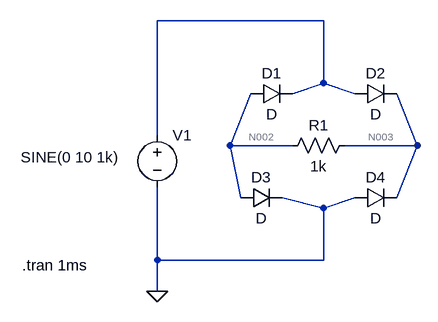
[diagram p0: schematic FULL_WAVE_GUI.asc]
FULL_WAVE_GUI.asc, the LTspice schematic file:
Version 4
SHEET 1 880 680
WIRE 256 64 0 64
WIRE 256 160 256 64
WIRE 208 176 256 160
WIRE 304 176 256 160
WIRE 0 240 0 64
WIRE 112 256 144 176
WIRE 208 256 112 256
WIRE 400 256 368 176
WIRE 400 256 288 256
WIRE 128 336 112 256
WIRE 368 336 400 256
WIRE 256 352 192 336
WIRE 256 352 304 336
WIRE 0 432 0 320
WIRE 256 432 256 352
WIRE 256 432 0 432
WIRE 0 480 0 432
FLAG 0 480 0
SYMBOL voltage 0 224 R0
WINDOW 3 -210 50 Left 2
WINDOW 123 0 0 Left 0
WINDOW 39 0 0 Left 0
SYMATTR Value SINE(0 10 1k)
SYMATTR InstName V1
SYMBOL diode 144 192 R270
WINDOW 0 32 32 VTop 2
WINDOW 3 0 32 VBottom 2
SYMATTR InstName D1
SYMBOL diode 304 192 R270
WINDOW 0 32 32 VTop 2
WINDOW 3 0 32 VBottom 2
SYMATTR InstName D2
SYMBOL diode 128 352 R270
WINDOW 0 32 32 VTop 2
WINDOW 3 0 32 VBottom 2
SYMATTR InstName D3
SYMBOL diode 304 352 R270
WINDOW 0 32 32 VTop 2
WINDOW 3 0 32 VBottom 2
SYMATTR InstName D4
SYMBOL res 304 240 R90
WINDOW 0 0 56 VBottom 2
WINDOW 3 32 56 VTop 2
SYMATTR InstName R1
SYMATTR Value 1k
TEXT -208 440 Left 2 !.tran 1ms

The netlist it stands for:
* FULL_WAVE_GUI.asc
V1 N001 0 SINE(0 10 1k)
D1 N002 N001 D
D2 N001 N003 D
D3 N002 0 D
D4 0 N003 D
R1 N003 N002 1k
.model D D
.lib standard.dio
.tran 1ms
.backanno
.end

* Results of the author's LTspice run, read from the files saved beside the schematic
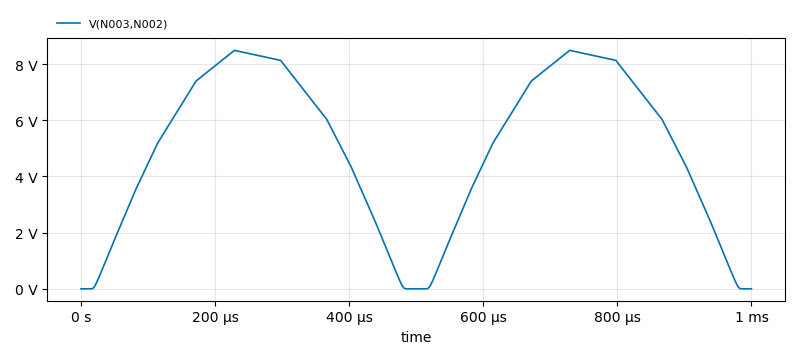
[diagram p1: Transient Analysis of FULL_WAVE_GUI.asc, plotted from the saved traces]
* Transient Analysis, 1 run:
*   V(N003,N002): min 0 V, max 8.491 V, average 4.975 V, rms 5.781 V, last 0 V